# EAGLE design PuenteH (EAGLE 7.5.0)
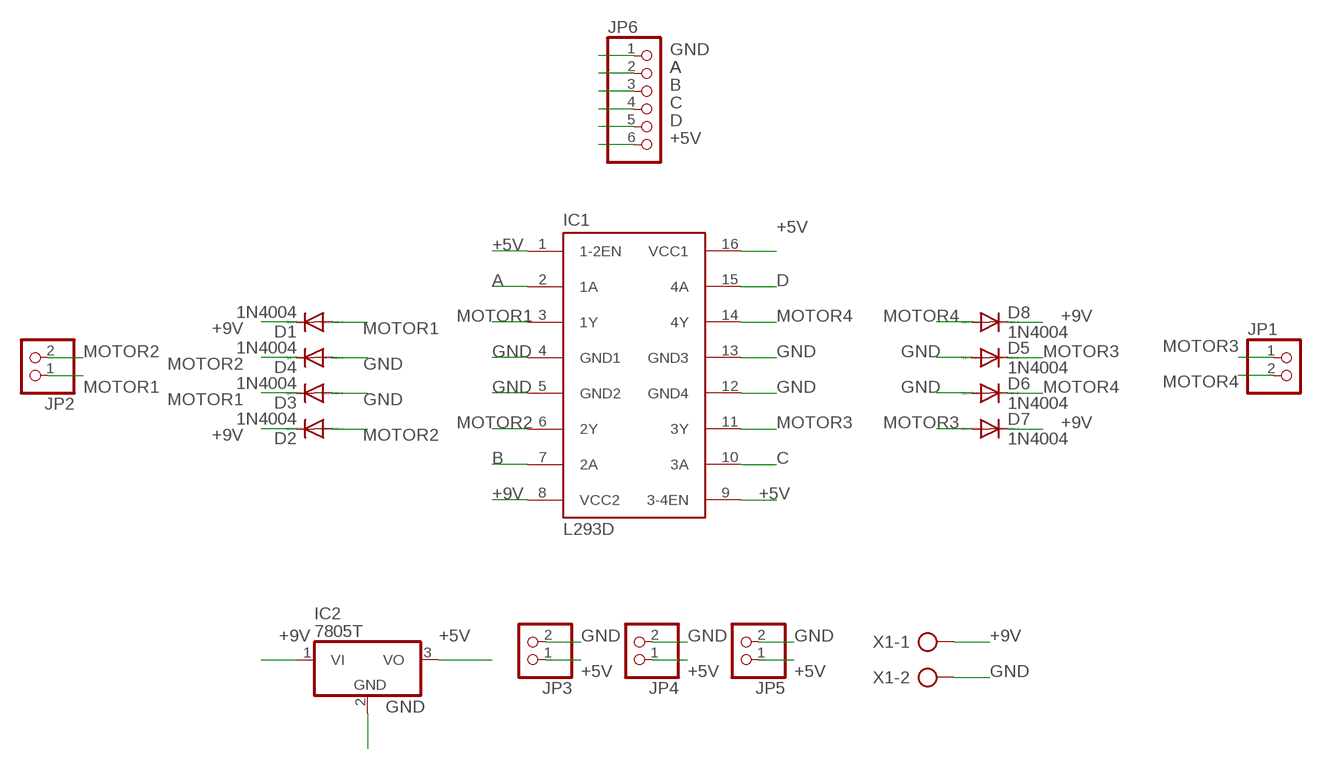
[diagram p0: schematic, sheet 1]

## Parts
D1  1N4004  [DO41-10]
D2  1N4004  [DO41-10]
D3  1N4004  [DO41-10]
D4  1N4004  [DO41-10]
D5  1N4004  [DO41-10]
D6  1N4004  [DO41-10]
D7  1N4004  [DO41-10]
D8  1N4004  [DO41-10]
IC1  L293D  [DIL16]
IC2  7805T  [TO220H]
JP1  PINHD-1X2  [1X02]
JP2  PINHD-1X2  [1X02]
JP3  PINHD-1X2  [1X02]
JP4  PINHD-1X2  [1X02]
JP5  PINHD-1X2  [1X02]
JP6  PINHD-1X6  [1X06]
X1  AK500/2-H  [AK500/2-H]

## Nets
+5V: IC1.1(1-2EN) IC1.9(3-4EN) IC1.16(VCC1) IC2.3(VO) JP3.1 JP4.1 JP5.1 JP6.6
+9V: D1.C D2.C D7.C D8.C IC1.8(VCC2) IC2.1(VI) X1.1
A: IC1.2(1A) JP6.2
B: IC1.7(2A) JP6.3
C: IC1.10(3A) JP6.4
D: IC1.15(4A) JP6.5
GND: D3.A D4.A D5.A D6.A IC1.4(GND1) IC1.5(GND2) IC1.12(GND4) IC1.13(GND3) IC2.2(GND) JP3.2 JP4.2 JP5.2 JP6.1 X1.2
MOTOR1: D1.A D3.C IC1.3(1Y) JP2.1
MOTOR2: D2.A D4.C IC1.6(2Y) JP2.2
MOTOR3: D5.C D7.A IC1.11(3Y) JP1.1
MOTOR4: D6.C D8.A IC1.14(4Y) JP1.2

## Library data of the parts
D1-D8 = diode:1N4004: DIODE general purpose rectifier, 1 A
IC1 = st-microelectronics:L293D: PUSH-PULL 4 CHANNEL DRIVER; MPN: L293D; OC_FARNELL: 9589619; OC_NEWARK: 56P8249
IC2 = linear:78*: Positive VOLTAGE REGULATOR Source: http://cache.national.com/ds/LM/LM78L05.pdf http://www.fairchildsemi.com/ds/LM/LM7805.pdf
JP1-JP5 = pinhead:PINHD-1X2: PIN HEADER
JP6 = pinhead:PINHD-1X6: PIN HEADER
X1 = con-ptr500:AK500/2-H: CONNECTOR Aug. 2004 / PTR Meßtechnik: Die Bezeichnung der Serie AK505 wurde geändert. Es handelt sich hierbei um AK500 in horizontaler Ausführung.; OC_FARNELL: unknown; OC_NEWARK: unknown

## Board
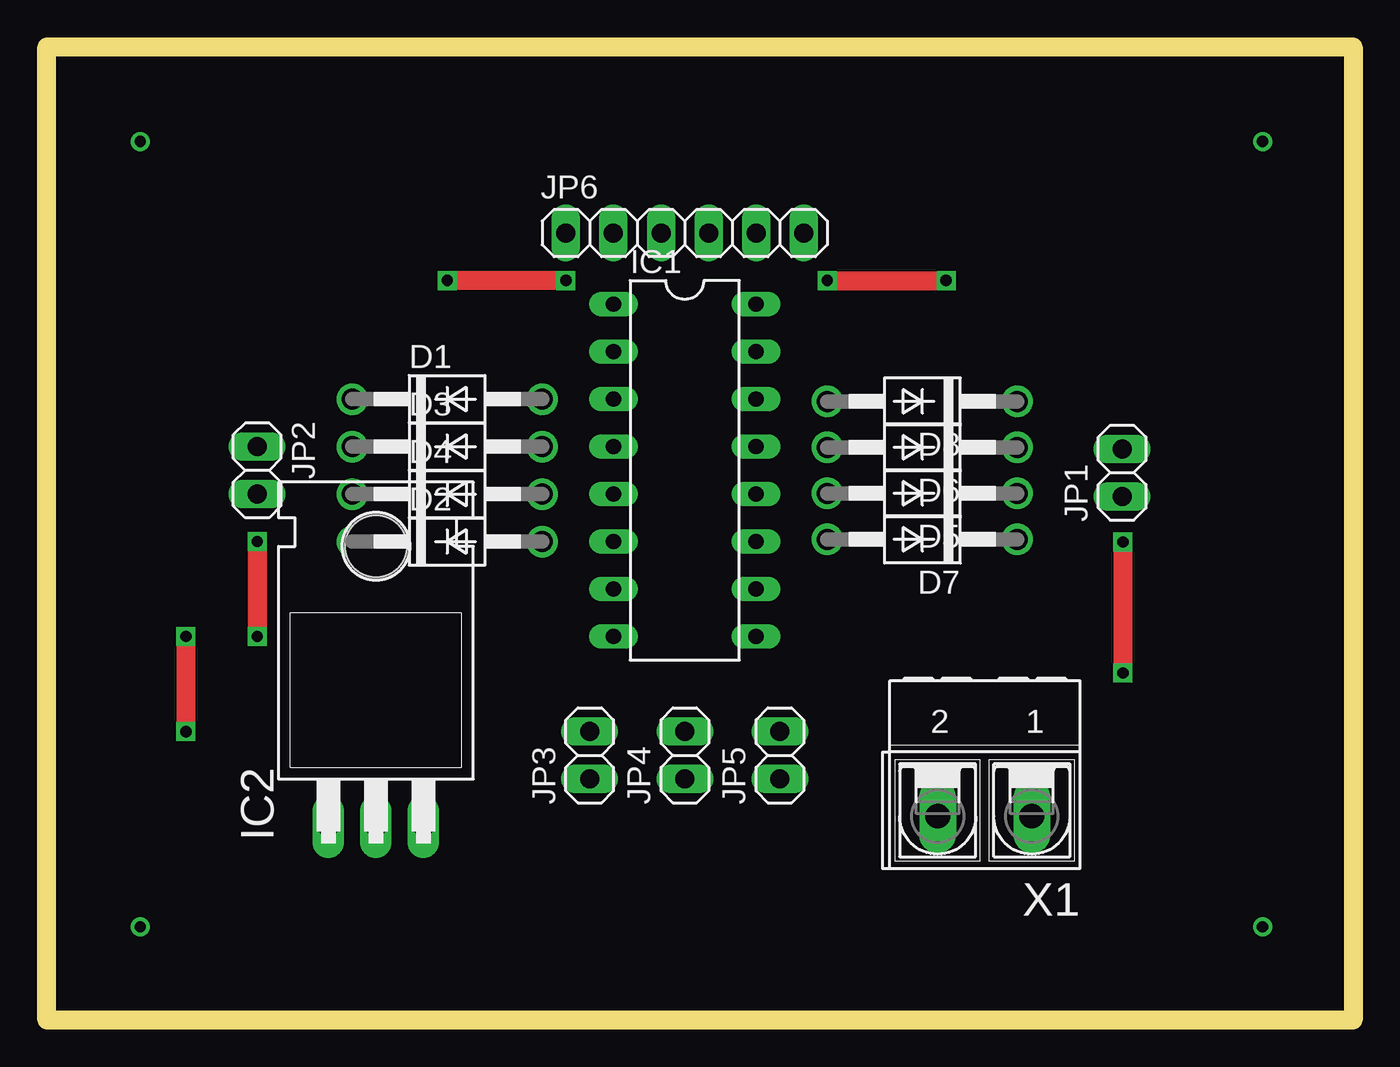
[diagram p1: board, top side]
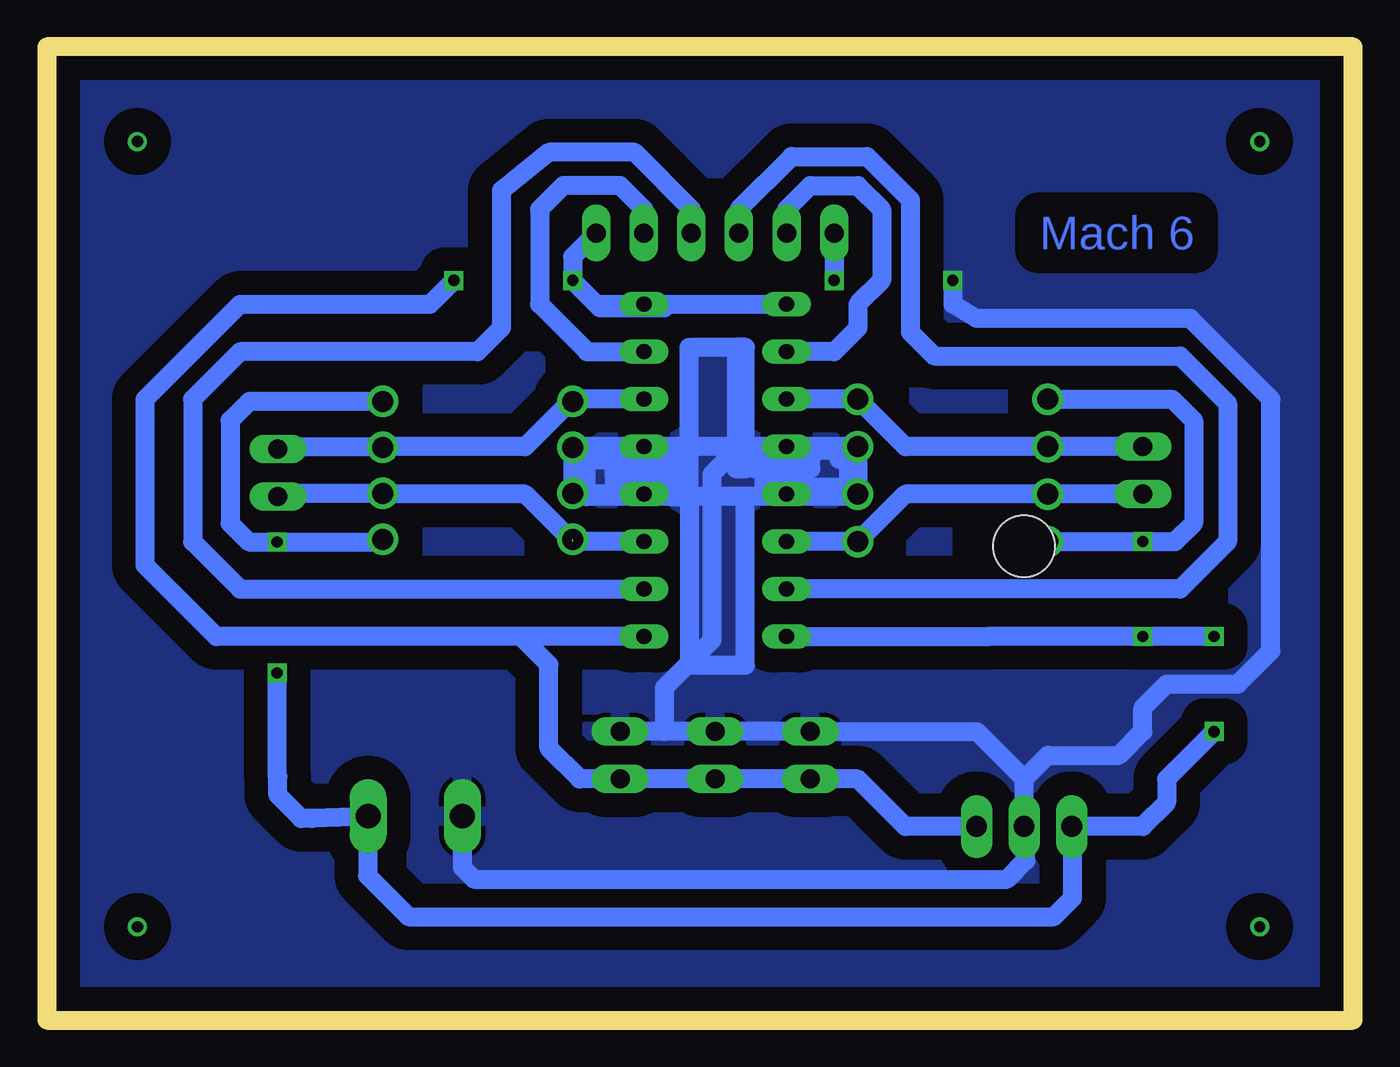
[diagram p2: board, bottom side, seen from below]

Size 69.85 x 52.07 mm. Coordinates in mm from the lower left corner, seen from the top.
Outline: 0,0 0,52.07 69.85,52.07 69.85,0 0,0
Copper layers (1*16): Top 0.035mm / dielectric 1.5mm / Bottom 0.035mm
Design rules "default": minimum track width 10mil, minimum drill 24mil, track to track 8mil, track to pad 8mil, pad to pad 8mil, via to via 8mil, smd to smd 8mil, copper to edge 40mil, drill to drill 8mil, minimum pad ring 10mil, minimum via ring 8mil, stop-mask expansion 4mil, vias tented up to drill 0mil, thermal gap 10mil

### Footprints (pad centres in the part's own frame; a part is rotated, then mirrored left to right if it is on the bottom)
DO41-10 = drill 1.118: A 5.08,0; C -5.08,0
DIL16 = drill 0.813 long: 1 -8.89,-3.81; 2 -6.35,-3.81; 3 -3.81,-3.81; 4 -1.27,-3.81; 5 1.27,-3.81; 6 3.81,-3.81; 7 6.35,-3.81; 8 8.89,-3.81; 9 8.89,3.81; 10 6.35,3.81; 11 3.81,3.81; 12 1.27,3.81; 13 -1.27,3.81; 14 -3.81,3.81; 15 -6.35,3.81; 16 -8.89,3.81
TO220H = drill 1.118 long: 1 -2.54,-10.16; 2 0,-10.16; 3 2.54,-10.16 | hole 3.302: 0,4.826
1X02 = drill 1.016 long: 1 -1.27,0; 2 1.27,0
1X06 = drill 1.016 long: 1 -6.35,0; 2 -3.81,0; 3 -1.27,0; 4 1.27,0; 5 3.81,0; 6 6.35,0
AK500/2-H = drill 1.321 long: 1 -2.515,0; 2 2.515,0

### Placement (x,y rotation side)
D1  21.41,33.22 0 top
D2  21.41,25.6 0 top
D3  21.41,30.68 0 top
D4  21.41,28.14 0 top
D5  46.81,28.18 180 top
D6  46.81,30.64 180 top
D7  46.81,25.72 180 top
D8  46.81,33.1 180 top
IC1  34.11,29.41 270 top
IC2  17.6,20.52 0 top
JP1  57.49,29.29 90 top
JP2  11.25,29.41 270 top
JP3  29.03,14.17 90 top
JP4  34.11,14.17 90 top
JP5  39.19,14.17 90 top
JP6  34.11,42.11 0 top
X1  50.15,10.91 180 top

### Tracks (layer width: path | path; a pad name or v marks a point on that pad's centre or on a via)
+5V  (via drill 0.6 pad 1.02)
  Top 1.016: v41.73,39.57 v48.08,39.57
  Bottom 1.016: JP6.6 41.73,40.84 v41.73,39.57 40.46,38.3 | 40.46,38.3 IC1.16 | IC1.16 IC1.1 | IC2.3 23.95,10.36 26.49,12.9 JP3.1 JP4.1 JP5.1 41.36,12.9 43,14.54 43,19.02 44.5,20.52 | IC1.9 44.5,20.52 | 44.5,20.52 60.78,20.52 64.59,24.33 64.59,33.22 59.51,38.3 49.35,38.3 v48.08,39.57 | IC1.16 37.03,38.3 36.83,38.1 40.26,38.1 40.46,38.3
+9V  (via drill 0.6 pad 1.02)
  Top 1.016: v11.25,25.6 v11.25,20.52 | v7.44,20.52 v7.44,15.44 | v57.54,25.58 v57.54,18.58
  Bottom 1.016: D1.C 9.68,33.22 8.54,32.08 8.54,26.58 9.52,25.6 | 9.52,25.6 9.54,25.58 16.31,25.58 D2.C | v7.44,15.44 9.98,12.9 9.98,11.63 11.25,10.36 IC2.1 15,10.3 15,6.54 16,5.54 50.5,5.54 52.69,7.73 52.69,10.91 X1.1 55.66,10.79 56.26,10.79 57.5,12.04 57.5,13.04 57.54,13.08 v57.54,18.58 | v11.25,25.6 9.52,25.6 | D8.C 59.02,33.1 60.04,32.08 60.04,26.58 59.04,25.58 v57.54,25.58 52.03,25.58 D7.C | v7.44,20.52 v11.25,20.52 11.27,20.54 19.5,20.54 19.52,20.52 IC1.8
A
  Bottom 1.016: JP6.2 30.3,43.38 29.03,44.65 26.49,44.65 25.22,43.38 25.22,39.57 26.49,38.3 26.49,37.03 27.76,35.76 IC1.2
B
  Bottom 1.016: JP6.3 32.84,43.38 30.03,46.19 25.99,46.19 23.68,43.88 23.68,36.8 22.41,35.53 9.25,35.53 6.71,32.99 6.71,25.6 9.25,23.06 IC1.7
C
  Bottom 1.016: JP6.4 35.38,43.38 38.42,46.42 43,46.42 45.54,44.38 45.54,37.03 46.81,35.76 59.51,35.76 62.05,33.22 62.05,25.6 59.51,23.06 IC1.10
D
  Bottom 1.016: JP6.5 37.92,43.38 39.19,44.65 42.23,44.65 43.5,43.38 43.5,38.3 40.96,35.76 IC1.15
GND  (via drill 0.6 pad 1.02)
  Top 1.016: v27.76,39.57 v21.41,39.57
  Bottom 1.016: D4.A IC1.5 IC1.4 | IC1.4 D3.A 32.82,30.68 34.29,29.21 34.29,20.32 36.83,17.78 36.83,15.44 | IC1.12 41.69,28.14 D5.A D6.A 41.69,30.68 IC1.13 IC1.4 | JP6.1 v27.76,39.57 | 17.6,12.9 IC2.2 17.5,10.26 17.5,8.54 18.5,7.54 47,7.54 47.63,8.18 X1.2 | 17.6,12.9 16.33,14.17 12.52,14.17 11.25,15.44 11.25,16.71 9.98,17.98 6.17,17.98 4.4,19.75 4.4,33.22 8.71,37.53 20.14,37.53 21.41,38.3 v21.41,39.57 | 17.6,12.9 20.14,15.44 JP3.2 JP4.2 36.83,15.44 | 36.83,15.44 JP5.2 | 27.5,30 27,30 27,28.5 30,28.5 | 30.5,28.5 30,28.5 | 30,28.5 30,30 29.5,30 29.5,29.5 29,29.5 29,30 31,30 31,28.5 31.5,28.5 31.5,29.5 32,29.5 32,30 31.5,30 31.5,30.5 26.5,30.5 26.5,28 32.5,28 | 32.5,28 35.5,28 | 36.5,28 41,28 41,30 39.5,30 | 39.5,30 39.5,30.5 37.5,30.5 37.5,30 37,30 37,29 39.5,29 | 39.5,29 39.5,28.5 | 39.5,29 39.5,29.5 38.5,29.5 38.5,30 | 38.5,30 39.5,30 | 38.5,30 36.5,30 36.5,28 | 36.5,28 35.5,28 | 35.5,28 35.5,36 33,36 | 33,36 33,29.5 32.5,29.5 32.5,36 33,36 | 35.5,28 35.5,19 32.5,19 32.5,28
  pour Bottom (isolate 1.27): 0,0 0,52.07 69.85,52.07 69.85,0
MOTOR1
  Bottom 1.016: JP2.1 D3.C 23.95,30.68 D1.A IC1.3
MOTOR2
  Bottom 1.016: JP2.2 D4.C 23.95,28.14 D2.A IC1.6
MOTOR3  (1 unrouted)
  Bottom 1.016: IC1.11 41.73,25.6 44.27,28.14 51.85,28.14 D5.C 57.33,28.18 JP1.1
MOTOR4
  Bottom 1.016: IC1.14 41.61,33.22 D8.A 41.85,33.1 44.27,30.68 51.93,30.68 | JP1.2 57.37,30.68 51.93,30.68 | 51.93,30.68 D6.C
N$5  (via drill 0.6 pad 1.02)
  other vias: 5,47
N$6  (via drill 0.6 pad 1.02)
  other vias: 5,5
N$7  (via drill 0.6 pad 1.02)
  other vias: 65,5
N$8  (via drill 0.6 pad 1.02)
  other vias: 65,47

### Text on the board
Bottom: Mach 6